# EAGLE design Switched_I2C (EAGLE 8.5.1)
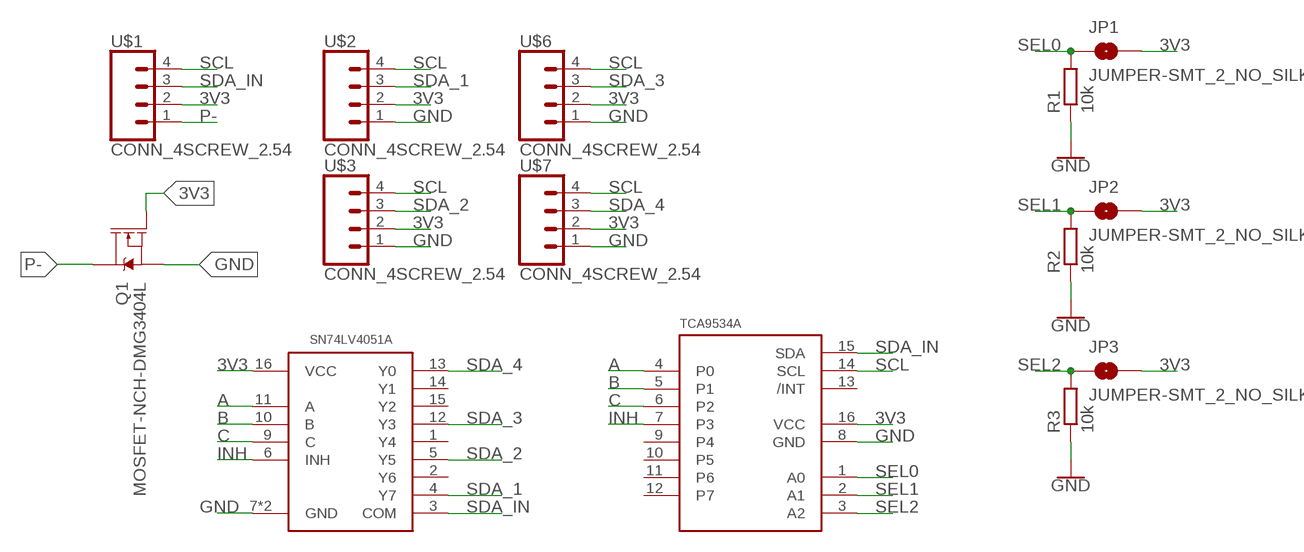
[diagram p0: schematic, sheet 1]

## Parts
JP1  JUMPER-SMT_2_NO_SILK  [SMT-JUMPER_2_NO_SILK]
JP2  JUMPER-SMT_2_NO_SILK  [SMT-JUMPER_2_NO_SILK]
JP3  JUMPER-SMT_2_NO_SILK  [SMT-JUMPER_2_NO_SILK]
Q1  MOSFET-NCH-DMG3404L  [SOT23-3]
R1  10k  R-EU_R0603  [R0603]
R2  10k  R-EU_R0603  [R0603]
R3  10k  R-EU_R0603  [R0603]
U$1  CONN_4SCREW_2.54  [1X04]
U$2  CONN_4SCREW_2.54  [1X04]
U$3  CONN_4SCREW_2.54  [1X04]
U$5  SN74LV4051ATSSOP  [TSSOP16]
U$6  CONN_4SCREW_2.54  [1X04]
U$7  CONN_4SCREW_2.54  [1X04]
U$8  TCA9534A  [TSSOP16]

## Nets
3V3: JP1.2 JP2.2 JP3.2 Q1.1(G) U$1.2 U$2.2 U$3.2 U$5.16(VCC) U$6.2 U$7.2 U$8.16(VCC)
A: U$5.11(A) U$8.4(P0)
B: U$5.10(B) U$8.5(P1)
C: U$5.9(C) U$8.6(P2)
GND: Q1.2(S) R1.1 R2.1 R3.1 U$2.1 U$3.1 U$5.7(GND) U$5.8(GND) U$6.1 U$7.1 U$8.8(GND)
INH: U$5.6(INH) U$8.7(P3)
P-: Q1.3(D) U$1.1
SCL: U$1.4 U$2.4 U$3.4 U$6.4 U$7.4 U$8.14(SCL)
SDA_1: U$2.3 U$5.4(Y7)
SDA_2: U$3.3 U$5.5(Y5)
SDA_3: U$5.12(Y3) U$6.3
SDA_4: U$5.13(Y0) U$7.3
SDA_IN: U$1.3 U$5.3(COM) U$8.15(SDA)
SEL0: JP1.1 R1.2 U$8.1(A0)
SEL1: JP2.1 R2.2 U$8.2(A1)
SEL2: JP3.1 R3.2 U$8.3(A2)
Unconnected: U$5.1(Y4) U$5.2(Y6) U$5.14(Y1) U$5.15(Y2) U$8.9(P4) U$8.10(P5) U$8.11(P6) U$8.12(P7) U$8.13(/INT)

## Library data of the parts
JP1-JP3 = SparkFun-Jumpers:JUMPER-SMT_2_NO: Normally open jumper This jumper has two pads in close proximity to each other. Apply solder to close the connection. Round pads are easier to solder for beginners, but are a lot larger. SparkFun Product that uses the round pads: SparkFun EL Sequencer <https://www.sparkfun.com/products/12781>
Q1 = bschulz:MOSFET-NCH: N-channel MOSFETs Voltage controlled devices that allow control of high current outputs. SparkFun Products: SparkFun OpenScale <https://www.sparkfun.com/products/13261> SparkFun Digital Sandbox <https://www.sparkfun.com/products/12651> SparkFun Monster Moto Shield <https://www.sparkfun.com/products/10182> SparkFun MOSFET Power Controller <https://www.sparkfun.com/products/11214>
R1-R3 = bschulz_passives:R-EU_: RESISTOR, European symbol
U$1-U$3 U$6 U$7 = bschulz:CONN_4: Genaric 4 pin connector
U$5 = bschulz:SN74LV4051A: SN74LV4051A - Analog Multiplexer Characteristics: VCC: 2~5.5V Operating Temperature: -40°C to 85°C On state resistace: 75 Ω, Max Channel to Channel Matching: 1.3 Ω, Typical Digikey: 296-41644-1-ND (TSSOP) <https://www.digikey.com/product-detail/en/texas-instruments/SN74LV4051APWRG4/296-41644-1-ND/5224383> 296-13945-1-ND (VQFN) <https://www.digikey.com/product-detail/en/texas-instruments/SN74LV4051ARGYR/296-13945-1-ND/521511>; DIGIKEY: 296-41644-1-ND; MF: TI; MPN: SN74LV4051APWRG4
U$8 = bschulz:TCA9534A: IO Expander, I2C, 3.3V and 5V compatable, 8 input/output, intterupt pin drive

## Board
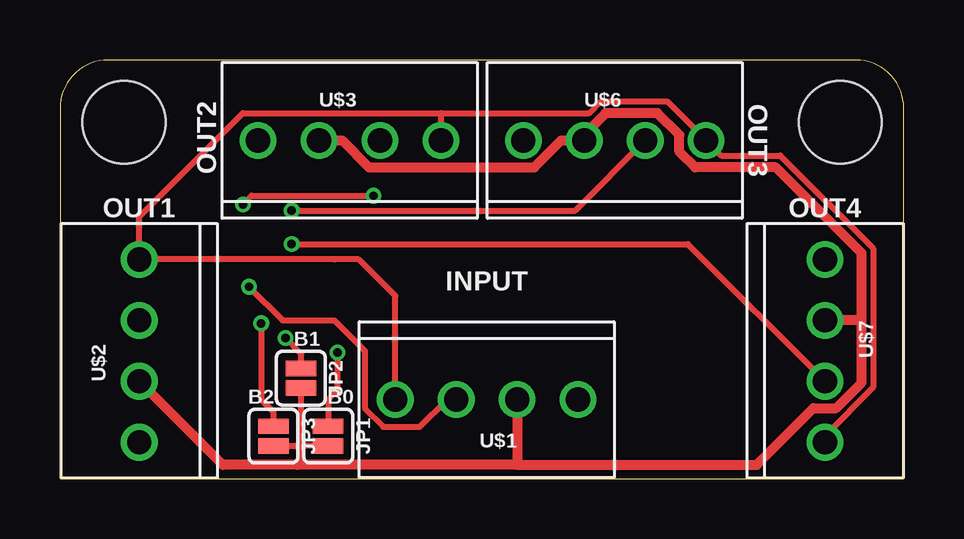
[diagram p1: board, top side]
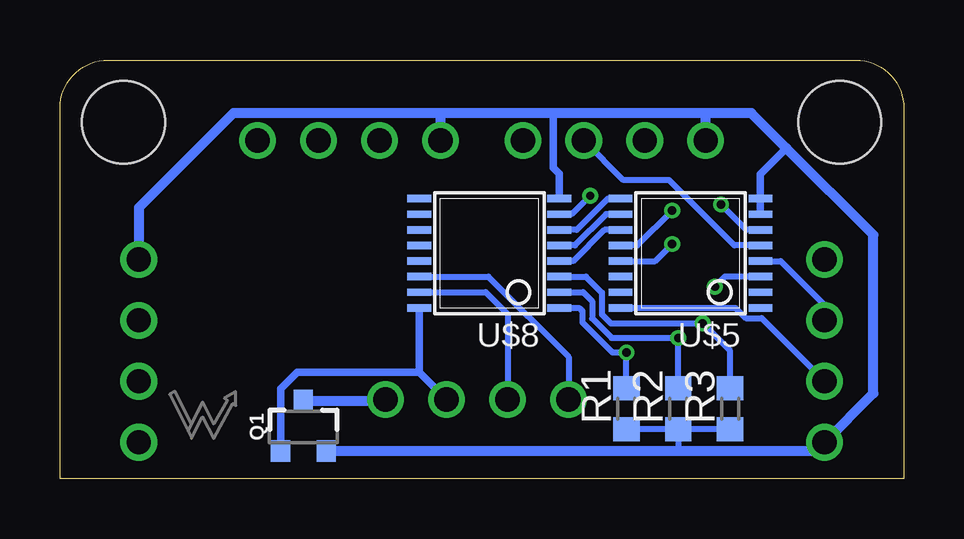
[diagram p2: board, bottom side, seen from below]

Size 35.16 x 17.45 mm. Coordinates in mm from the lower left corner, seen from the top.
Outline: 0,0 35.16,0 35.16,15.45 arc90 33.16,17.45 2,17.45 arc90 0,15.45 0,0
Copper layers (1*16): Top 0.035559375mm / dielectric 1.6mm / Bottom 0.035559375mm
Design rules "BayArea-2layer": minimum track width 6mil, minimum drill 10mil, track to track 6mil, track to pad 6mil, pad to pad 6mil, via to via 6mil, smd to smd 6mil, copper to edge 15mil, drill to drill 6mil, minimum pad ring 6mil, minimum via ring 6mil, stop-mask expansion 2.5mil, vias tented up to drill 0mil, thermal gap 10mil
Holes 3.45 mm at 32.51,14.86 2.67,14.86

### Footprints (pad centres in the part's own frame; a part is rotated, then mirrored left to right if it is on the bottom)
SMT-JUMPER_2_NO_SILK = smd 0.635 x 1.27: 1 -0.406,0; 2 0.406,0
SOT23-3 = smd 0.8 x 0.9: 1 -0.95,-1; 2 0.95,-1; 3 0,1.1
R0603 = smd 1 x 1.1: 1 -0.85,0; 2 0.85,0
1X04 = drill 1.016: 1 -3.81,0; 2 -1.27,0; 3 1.27,0; 4 3.81,0
TSSOP16 = smd 0.305 x 0.991: 1 -2.275,-2.918; 2 -1.625,-2.918; 3 -0.975,-2.918; 4 -0.325,-2.918; 5 0.325,-2.918; 6 0.975,-2.918; 7 1.625,-2.918; 8 2.275,-2.918; 9 2.275,2.918; 10 1.625,2.918; 11 0.975,2.918; 12 0.325,2.918; 13 -0.325,2.918; 14 -0.975,2.918; 15 -1.625,2.918; 16 -2.275,2.918

### Placement (x,y rotation side)
JP1  11.18,1.78 270 top
JP2  10.03,4.19 270 top
JP3  8.89,1.78 270 top
Q1  25.02,2.16 0 bottom
R1  11.56,2.92 90 bottom
R2  9.4,2.92 90 bottom
R3  7.24,2.92 90 bottom
U$1  17.78,3.3 180 top
U$2  3.3,5.33 90 top
U$3  12.06,14.1 0 top
U$5  8.89,9.4 90 bottom
U$6  23.11,14.1 0 top
U$7  31.88,5.33 270 top
U$8  17.27,9.4 90 bottom
U$9  [NWLOGO_SMALL]  29.21,2.54 0 bottom

### Tracks (layer width: path | path; a pad name or v marks a point on that pad's centre or on a via)
3V3
  Top 0.254: JP1.2 10.03,1.37 | JP2.2 10.03,1.37 | 10.03,1.37 10.03,0.71 9.91,0.58 | JP3.2 10.03,1.37
  Top 0.406: U$3.2 11.75,14.1 12.87,12.98 19.77,12.98 20.89,14.1 21.59,14.1 | 21.59,14.1 U$6.2 | 33.4,6.6 33.4,4.01 32.34,2.95 31.39,2.95 29.03,0.58 19.05,0.58 | 33.4,6.6 U$7.2 | 33.4,6.6 33.4,9.4 29.82,12.98 26.46,12.98 25.81,13.63 25.81,14.33 24.89,15.24 22.73,15.24 21.59,14.1 | U$2.2 6.78,0.58 9.91,0.58 19.05,0.58 | U$1.2 19.05,0.58
  Bottom 0.254: U$5.16 7.01,7.12 6.58,6.69 5.93,6.69 U$2.2 | U$8.16
  Bottom 0.305: U$1.2 20.19,4.45 | 20.19,4.45 U$8.16 | Q1.1 25.97,3.75 25.27,4.45 20.19,4.45
A
  Bottom 0.254: U$5.11 12.48,10.37 13.78,9.07 U$8.4
B
  Bottom 0.254: U$5.10 12.4,11.02 13.71,9.72 U$8.5
C
  Bottom 0.254: U$5.9 12.33,11.67 13.63,10.37 U$8.6
GND
  Bottom 0.254: R3.1 8.89,2.07 R2.1 | R2.1 R1.1 | R2.1 9.4,1.16
  Bottom 0.305: U$5.7 U$5.8 5.97,12.7 4.89,13.78 | U$8.8 14.35,12.7 14.61,12.95 14.61,15.24
  Bottom 0.406: U$7.1 31.88,11.3 27.94,15.24 19.43,15.24 | 8.38,15.24 6.35,15.24 4.89,13.78 1.27,10.16 1.27,3.56 U$2.1 3.67,1.16 8.89,1.16 9.4,1.16 Q1.2 | 8.38,15.24 14.61,15.24 19.43,15.24 | U$3.1 8.26,15.11 8.38,15.24 | U$6.1 19.3,15.11 19.43,15.24
INH  (via drill 0.35)
  Top 0.254: v7.62,11.43 7.99,11.8 v13.07,11.8
  Bottom 0.254: U$5.6 6.56,10.37 v7.62,11.43 | v13.07,11.8 13.84,11.02 U$8.7
P-
  Bottom 0.406: Q1.3 21.63,3.26 U$1.1
SCL
  Top 0.254: 15.88,15.24 7.62,15.24 3.3,10.92 U$2.4 11.43,9.14 12.45,9.14 13.97,7.62 U$1.4 | U$3.4 15.88,15.24 | 15.88,15.24 22.05,15.24 22.53,15.72 25.3,15.72 U$6.4 27.56,13.46 30.02,13.46 33.88,9.6 33.88,3.81 31.88,1.8 U$7.4
  Bottom 0.254: U$8.14 17.31,8.42 13.97,5.08 U$1.4
SDA_1
  Bottom 0.254: U$5.4 5.14,9.07 3.3,7.24 U$2.3
SDA_2
  Bottom 0.254: U$5.5 7.06,9.72 9.78,12.45 11.68,12.45 U$3.3
SDA_3  (via drill 0.35)
  Top 0.254: v9.65,11.18 21.46,11.18 U$6.3
  Bottom 0.254: v9.65,11.18 11.11,9.72 U$5.12
SDA_4  (via drill 0.35)
  Top 0.254: v9.65,9.78 26.16,9.78 U$7.3
  Bottom 0.254: U$5.13 10.36,9.07 v9.65,9.78
SDA_IN  (via drill 0.35)
  Top 0.254: U$1.3 16.13,3.3 14.99,2.16 13.46,2.16 12.7,2.92 12.7,5.33 11.43,6.6 9.27,6.6 v7.87,8
  Bottom 0.254: U$5.3 7.45,8.42 v7.87,8 | U$8.15 17.43,7.77 16.51,6.86 U$1.3
SEL0  (via drill 0.35)
  Top 0.254: v11.56,5.26 11.56,3.68 11.18,3.3 JP1.1
  Bottom 0.254: U$8.1 13.53,7.12 13.39,6.99 13.39,6.52 12.14,5.26 v11.56,5.26 R1.2
SEL1  (via drill 0.35)
  Top 0.254: v9.4,5.87 10.03,5.24 JP2.1
  Bottom 0.254: U$8.2 13.36,7.77 12.99,7.4 12.99,6.69 12.17,5.87 v9.4,5.87 R2.2
SEL2  (via drill 0.35)
  Top 0.254: JP3.1 8.89,2.79 8.38,3.3 v8.38,6.48
  Bottom 0.254: U$8.3 13.25,8.42 12.58,7.76 12.58,6.86 12.21,6.48 v8.38,6.48 7.24,5.33 R3.2

### Text on the board
tPlace: OUT2 | OUT3 | OUT1 | OUT4 | INPUT | B1 | B2 | B0
tDocu: GND | VCC | SDA | SCL | GND | VCC | SDA | SCL | SCL | GND | SDA | SCL | SDA | VCC | GND | VCC | VCC | SDA | SCL | GND
bDocu: Project Heptapod / Switch / ----------- / Designed by / Northern Widget and / University of Minnesota